# EAGLE schematic heatflow (EAGLE 7.5.0)
AUTOR: Luca Brügger
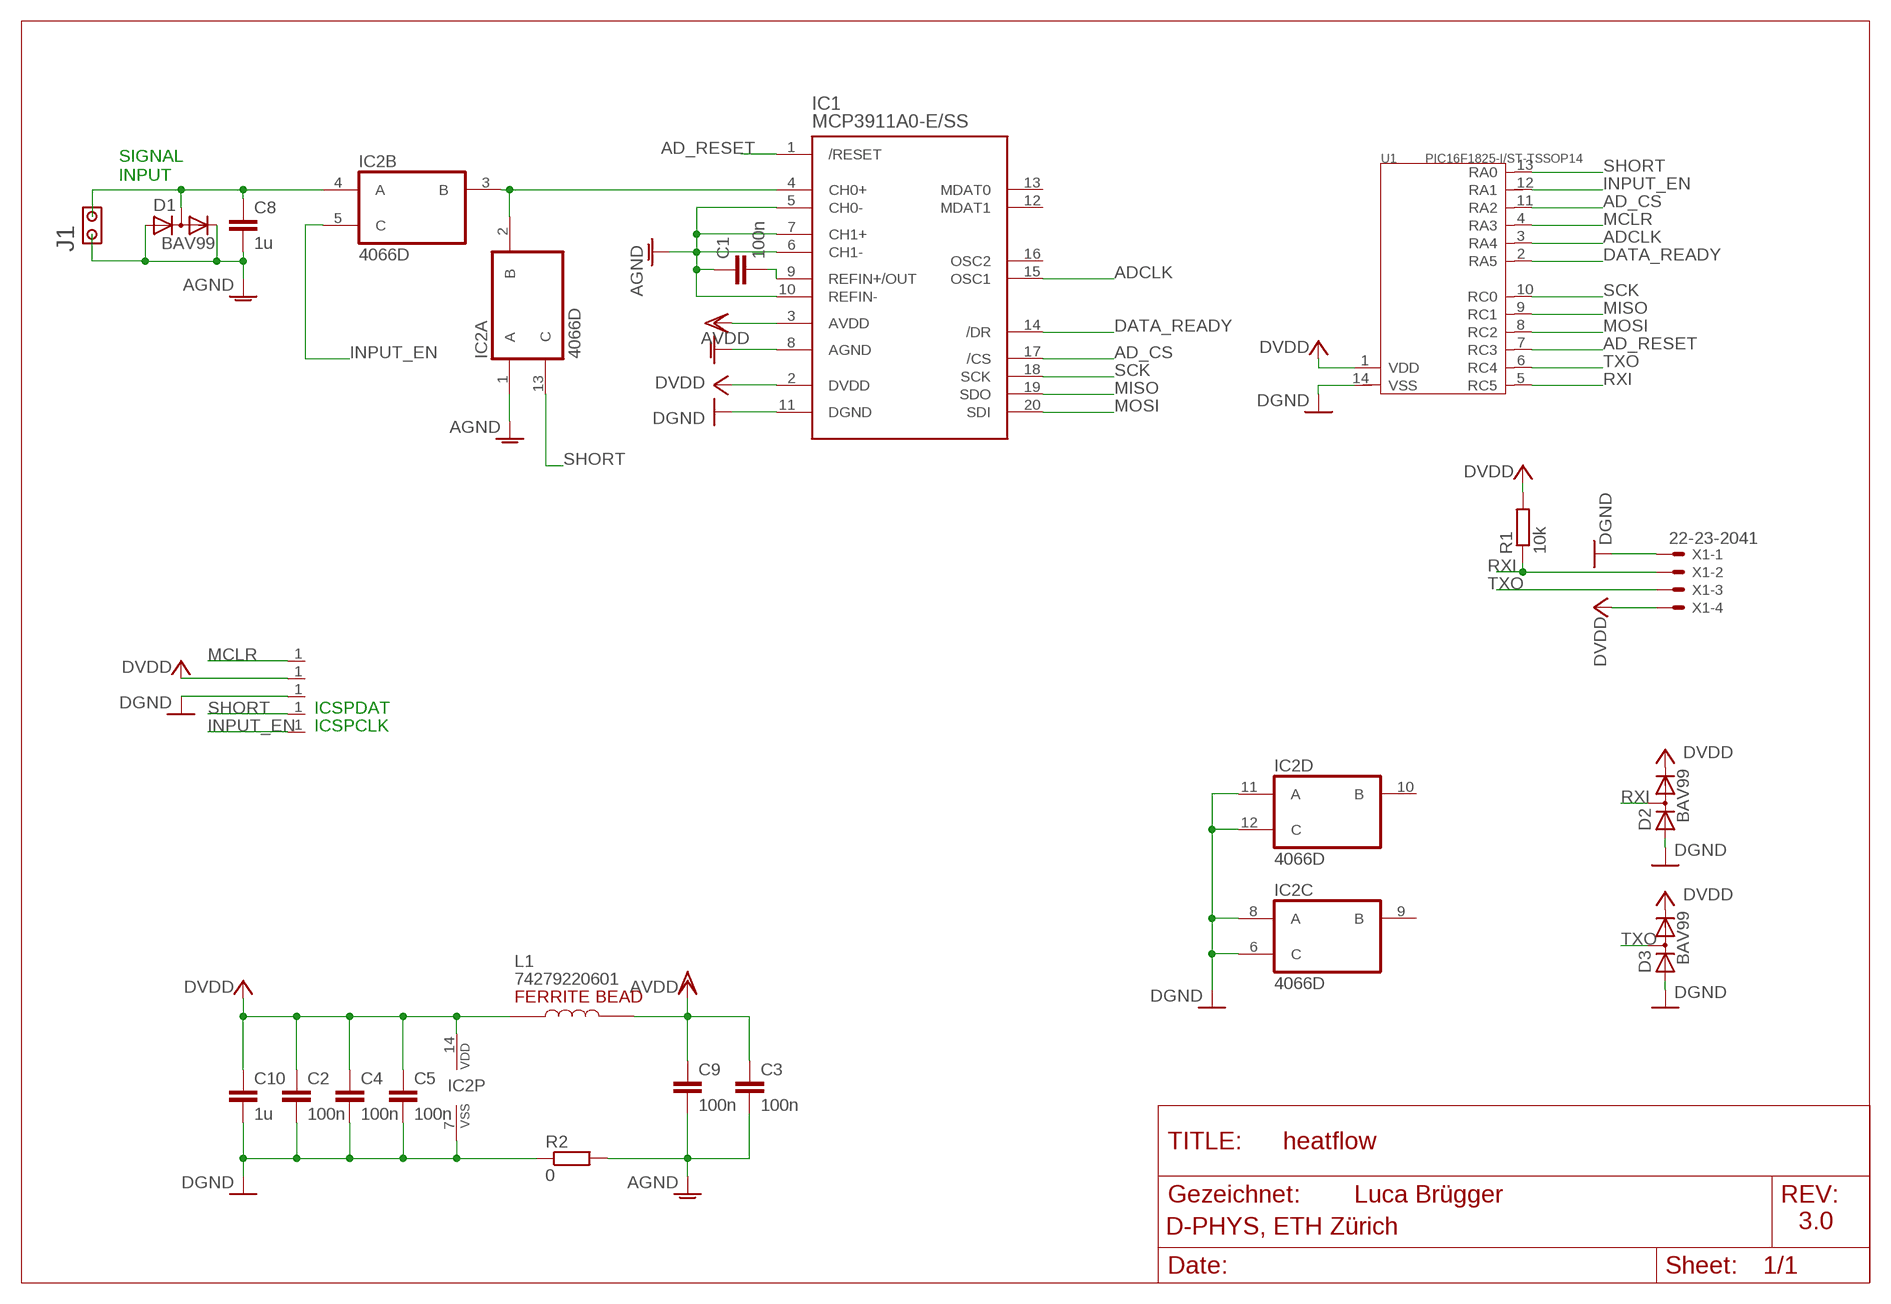
[diagram p0: schematic, sheet 1]

## Parts
C1  100n  C-EUC0805  [C0805]
C2  100n  C-EUC0805  [C0805]
C3  100n  C-EUC0805  [C0805]
C4  100n  C-EUC0805  [C0805]
C5  100n  C-EUC0805  [C0805]
C8  1u  C-EUC0805  [C0805]
C9  100n  C-EUC0805  [C0805]
C10  1u  C-EUC0805  [C0805]
D1  BAV99  [SOT23]
D2  BAV99  [SOT23]
D3  BAV99  [SOT23]
IC1  MCP3911A0-E/SS  [SSOP20]
IC2  4066D  [SO14]
J1  CON2X1  [CON2X1]
L1  74279220601  [0805]
PIN1  CON1X1  [CON1X1]
PIN2  CON1X1  [CON1X1]
PIN3  CON1X1  [CON1X1]
PIN4  CON1X1  [CON1X1]
PIN5  CON1X1  [CON1X1]
R1  10k  R-EU_M0805  [M0805]
R2  0  R-EU_M0805  [M0805]
U1  PIC16F1825-I/ST-TSSOP14  MCU-PIC16F1825-I/ST(TSSOP14)  [TSSOP14-0.65-5X4.4MM]
X1  22-23-2041  [22-23-2041]

## Nets
AD_CS: IC1.17(/CS) U1.11(RA2)
AD_RESET: IC1.1(/RESET) U1.7(RC3)
ADCLK: IC1.15(OSC1) U1.3(RA4)
AGND: C1.1 C3.2 C8.2 C9.2 D1.1(A) D1.2(C) IC1.5(CH0-) IC1.6(CH1-) IC1.7(CH1+) IC1.8(AGND) IC1.10(REFIN-) IC2.1(A:A) J1.1 R2.2
AVDD: C3.1 C9.1 IC1.3(AVDD) L1.2
DATA_READY: IC1.14(/DR) U1.2(RA5)
DGND: C2.2 C4.2 C5.2 C10.2 D2.1(A) D3.1(A) IC1.11(DGND) IC2.6(C:C) IC2.7(P:VSS) IC2.8(C:A) IC2.11(D:A) IC2.12(D:C) PIN3.1 R2.1 U1.14(VSS) X1.1
DVDD: C2.1 C4.1 C5.1 C10.1 D2.2(C) D3.2(C) IC1.2(DVDD) IC2.14(P:VDD) L1.1 PIN2.1 R1.2 U1.1(VDD) X1.4
INPUT_EN: IC2.5(B:C) PIN5.1 U1.12(RA1)
MCLR: PIN1.1 U1.4(RA3)
MISO: IC1.19(SDO) U1.9(RC1)
MOSI: IC1.20(SDI) U1.8(RC2)
N$2: C1.2 IC1.9(REFIN+/OUT)
N$8: IC1.4(CH0+) IC2.2(A:B) IC2.3(B:B)
N$12: C8.1 D1.3(AC) IC2.4(B:A) J1.2
RXI: D2.3(AC) R1.1 U1.5(RC5) X1.2
SCK: IC1.18(SCK) U1.10(RC0)
SHORT: IC2.13(A:C) PIN4.1 U1.13(RA0)
TXO: D3.3(AC) U1.6(RC4) X1.3
Unconnected: IC1.12(MDAT1) IC1.13(MDAT0) IC1.16(OSC2) IC2.9(C:B) IC2.10(D:B)

## Notes on the sheet
- SIGNAL
  INPUT
- ICSPDAT
- ICSPCLK
- 3.0

## Library data of the parts
C1-C5 C8-C10 = heatflow:C-EU: CAPACITOR, European symbol
D1-D3 = LEDXLamp:BAV99
IC1 = heatflow:MCP3911A0-E/*
IC2 = 40xx:4066: Quad bilateral ANALOG SWITCH
J1 = Stecker_Pins:CON2X1: Pin-Leiste, 2*1
L1 = heatflow2:74279220601: Multilayer Bead SMD, Würth Elektronik Typ: 74279220601
PIN1-PIN5 = Stecker_Pins:CON1X1: Pin-Leiste, 1*1
R1 R2 = resistor:R-EU_: RESISTOR, European symbol
U1 = heatflow:MCU-PIC16F1825-I/ST(TSSOP14): 310010120; MPN: PIC16F1825-I/ST
X1 = heatflow:22-23-2041: .100" (2.54mm) Center Header - 4 Pin; MF: MOLEX; MPN: 22-23-2041; OC_FARNELL: 1462920; OC_NEWARK: 38C0355